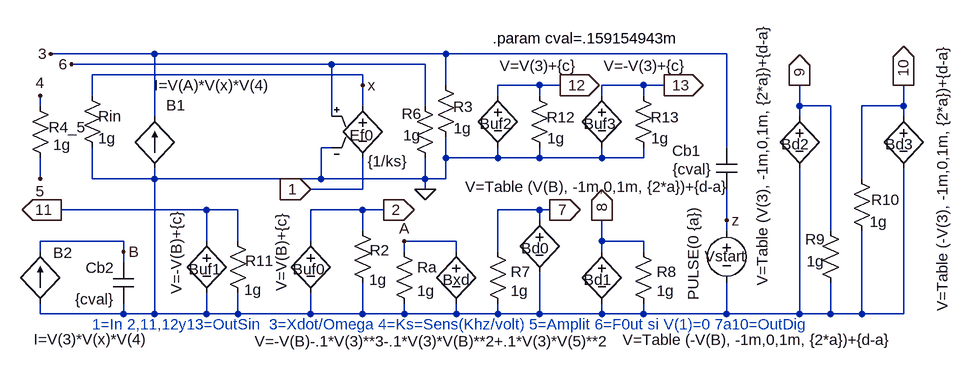
[diagram p0: schematic vcodig.asc]
vcodig.asc, the LTspice schematic file:
Version 4
SHEET 1 1252 680
WIRE -336 176 -336 160
WIRE -336 288 -336 256
WIRE -336 400 -336 384
WIRE -336 496 -336 480
WIRE -256 160 -256 128
WIRE -256 288 -256 240
WIRE -208 384 -336 384
WIRE -208 400 -208 384
WIRE -208 416 -208 400
WIRE -208 496 -336 496
WIRE -208 496 -208 480
WIRE -160 96 -320 96
WIRE -160 192 -160 96
WIRE -160 288 -256 288
WIRE -160 288 -160 272
WIRE -160 496 -208 496
WIRE -160 496 -160 288
WIRE -80 336 -304 336
WIRE -80 384 -80 336
WIRE -80 496 -160 496
WIRE -80 496 -80 464
WIRE -32 336 -80 336
WIRE -32 384 -32 336
WIRE -32 496 -80 496
WIRE -32 496 -32 464
WIRE 80 384 80 336
WIRE 80 496 -32 496
WIRE 80 496 80 464
WIRE 96 288 -160 288
WIRE 96 288 96 240
WIRE 112 112 -288 112
WIRE 112 192 112 112
WIRE 112 240 96 240
WIRE 160 128 -256 128
WIRE 160 144 160 128
WIRE 160 176 160 144
WIRE 160 304 80 304
WIRE 160 304 160 256
WIRE 160 336 80 336
WIRE 160 368 160 336
WIRE 160 496 80 496
WIRE 160 496 160 448
WIRE 192 336 160 336
WIRE 224 400 224 384
WIRE 224 496 160 496
WIRE 224 496 224 480
WIRE 256 112 112 112
WIRE 256 176 256 112
WIRE 256 288 96 288
WIRE 256 288 256 256
WIRE 256 304 256 288
WIRE 288 96 -160 96
WIRE 288 144 288 96
WIRE 288 256 288 224
WIRE 288 288 256 288
WIRE 288 288 288 256
WIRE 304 384 224 384
WIRE 304 400 304 384
WIRE 304 496 224 496
WIRE 304 496 304 480
WIRE 368 160 368 144
WIRE 368 256 288 256
WIRE 368 256 368 240
WIRE 368 400 368 336
WIRE 368 496 304 496
WIRE 368 496 368 480
WIRE 432 144 368 144
WIRE 432 160 432 144
WIRE 432 256 368 256
WIRE 432 256 432 240
WIRE 432 336 368 336
WIRE 432 352 432 336
WIRE 432 496 368 496
WIRE 432 496 432 432
WIRE 448 336 432 336
WIRE 464 144 432 144
WIRE 528 160 528 144
WIRE 528 256 432 256
WIRE 528 256 528 240
WIRE 528 384 528 352
WIRE 528 400 528 384
WIRE 528 496 432 496
WIRE 528 496 528 480
WIRE 592 144 528 144
WIRE 592 160 592 144
WIRE 592 256 528 256
WIRE 592 256 592 240
WIRE 592 384 528 384
WIRE 592 400 592 384
WIRE 592 496 528 496
WIRE 592 496 592 480
WIRE 624 144 592 144
WIRE 720 96 288 96
WIRE 720 240 720 96
WIRE 720 352 720 304
WIRE 720 368 720 352
WIRE 720 496 592 496
WIRE 720 496 720 448
WIRE 832 176 832 144
WIRE 832 192 832 176
WIRE 832 496 720 496
WIRE 832 496 832 272
WIRE 880 176 832 176
WIRE 880 368 880 176
WIRE 880 496 832 496
WIRE 880 496 880 448
WIRE 928 288 928 176
WIRE 928 496 880 496
WIRE 928 496 928 368
WIRE 992 176 928 176
WIRE 992 176 992 144
WIRE 992 192 992 176
WIRE 992 496 928 496
WIRE 992 496 992 272
FLAG 256 304 0
FLAG 80 304 1
IOPIN 80 304 In
FLAG -320 96 3
FLAG -208 400 B
FLAG 224 384 A
FLAG 192 336 2
IOPIN 192 336 Out
FLAG 720 352 z
FLAG -336 160 4
FLAG -336 288 5
FLAG -288 112 6
FLAG 160 144 x
FLAG 448 336 7
IOPIN 448 336 Out
FLAG 464 144 12
IOPIN 464 144 Out
FLAG 832 144 9
IOPIN 832 144 Out
FLAG 528 352 8
IOPIN 528 352 Out
FLAG 992 144 10
IOPIN 992 144 Out
FLAG -304 336 11
IOPIN -304 336 Out
FLAG 624 144 13
IOPIN 624 144 Out
SYMBOL res -272 144 R0
WINDOW 0 25 48 Left 0
WINDOW 3 25 82 Left 0
SYMATTR InstName Rin
SYMATTR Value 1g
SYMBOL res 144 352 R0
WINDOW 0 27 46 Left 0
WINDOW 3 26 91 Left 0
SYMATTR InstName R2
SYMATTR Value 1g
SYMBOL bi -160 272 R180
WINDOW 0 -47 97 Left 0
WINDOW 3 -176 128 Left 0
SYMATTR InstName B1
SYMATTR Value I=V(A)*V(x)*V(4)
SYMBOL bi -336 480 R180
WINDOW 0 -49 78 Left 0
WINDOW 3 -165 -55 Left 0
SYMATTR InstName B2
SYMATTR Value I=V(3)*V(x)*V(4)
SYMBOL cap -224 416 R0
WINDOW 3 -58 57 Left 0
WINDOW 0 -42 9 Left 0
SYMATTR Value {cval}
SYMATTR InstName Cb2
SYMATTR SpiceLine Rpar=1g
SYMBOL bv 304 384 R0
WINDOW 0 -21 59 Left 0
WINDOW 3 -310 154 Left 0
SYMATTR InstName Bxd
SYMATTR Value V=-V(B)-.1*V(3)**3-.1*V(3)*V(B)**2+.1*V(3)*V(5)**2
SYMBOL res 208 384 R0
SYMATTR InstName Ra
SYMATTR Value 1g
SYMBOL voltage 720 352 R0
WINDOW 0 -34 55 Left 0
WINDOW 3 -51 -22 VRight 0
WINDOW 123 0 0 Left 0
WINDOW 39 0 0 Left 0
SYMATTR InstName Vstart
SYMATTR Value PULSE(0 {a})
SYMBOL cap 704 240 R0
WINDOW 0 -68 5 Left 0
WINDOW 3 -8 33 Right 0
SYMATTR InstName Cb1
SYMATTR Value {cval}
SYMBOL res -352 160 R0
WINDOW 0 29 49 Left 0
SYMATTR InstName R4_5
SYMATTR Value 1g
SYMBOL res 240 160 R0
WINDOW 0 -20 28 Left 0
WINDOW 3 -18 61 Left 0
SYMATTR InstName R6
SYMATTR Value 1g
SYMBOL e 160 160 R0
WINDOW 0 -20 61 Left 0
WINDOW 3 8 101 Left 0
SYMATTR InstName Ef0
SYMATTR Value {1/ks}
SYMBOL bv 432 336 R0
WINDOW 0 -28 59 Left 0
WINDOW 3 -114 -36 Left 0
SYMATTR InstName Bd0
SYMATTR Value V=Table (V(B), -1m,0,1m, {2*a})+{d-a}
SYMBOL res 352 384 R0
WINDOW 0 36 47 Left 0
SYMATTR InstName R7
SYMATTR Value 1g
SYMBOL res 272 128 R0
WINDOW 0 27 49 Left 0
WINDOW 3 28 82 Left 0
SYMATTR InstName R3
SYMATTR Value 1g
SYMBOL res 416 144 R0
WINDOW 0 27 49 Left 0
WINDOW 3 28 82 Left 0
SYMATTR InstName R12
SYMATTR Value 1g
SYMBOL bv 832 176 R0
WINDOW 0 -28 59 Left 0
WINDOW 3 -57 -131 VRight 0
SYMATTR InstName Bd2
SYMATTR Value V=Table (V(3), -1m,0,1m, {2*a})+{d-a}
SYMBOL bv 528 384 R0
WINDOW 0 -28 59 Left 0
WINDOW 3 32 152 Left 0
SYMATTR InstName Bd1
SYMATTR Value V=Table (-V(B), -1m,0,1m, {2*a})+{d-a}
SYMBOL bv 992 176 R0
WINDOW 0 -28 59 Left 0
WINDOW 3 60 316 VLeft 0
SYMATTR InstName Bd3
SYMATTR Value V=Table (-V(3), -1m,0,1m, {2*a})+{d-a}
SYMBOL bv 368 144 R0
WINDOW 0 -28 59 Left 0
WINDOW 3 3 -30 Left 0
SYMATTR InstName Buf2
SYMATTR Value V=V(3)+{c}
SYMBOL bv 80 368 R0
WINDOW 0 -28 59 Left 0
WINDOW 3 -45 -27 VRight 0
SYMATTR InstName Buf0
SYMATTR Value V=V(B)+{c}
SYMBOL bv -80 368 R0
WINDOW 0 -28 59 Left 0
WINDOW 3 -47 -31 VRight 0
SYMATTR InstName Buf1
SYMATTR Value V=-V(B)+{c}
SYMBOL res -48 368 R0
WINDOW 0 27 46 Left 0
WINDOW 3 26 91 Left 0
SYMATTR InstName R11
SYMATTR Value 1g
SYMBOL res 864 352 R0
WINDOW 0 -23 29 Left 0
WINDOW 3 -21 63 Left 0
SYMATTR InstName R9
SYMATTR Value 1g
SYMBOL res 576 384 R0
WINDOW 0 36 47 Left 0
SYMATTR InstName R8
SYMATTR Value 1g
SYMBOL res 576 144 R0
WINDOW 0 27 49 Left 0
WINDOW 3 28 82 Left 0
SYMATTR InstName R13
SYMATTR Value 1g
SYMBOL bv 528 144 R0
WINDOW 0 -28 59 Left 0
WINDOW 3 3 -30 Left 0
SYMATTR InstName Buf3
SYMATTR Value V=-V(3)+{c}
SYMBOL res 912 272 R0
WINDOW 0 30 48 Left 0
WINDOW 3 28 82 Left 0
SYMATTR InstName R10
SYMATTR Value 1g
TEXT -256 512 Left 0 ;1=In 2,11,12y13=OutSin  3=Xdot/Omega 4=Ks=Sens(Khz/volt) 5=Amplit 6=F0ut si V(1)=0 7a10=OutDig
TEXT 360 72 Left 0 !.param cval=.159154943m

The netlist it stands for:
* vcodig.asc
Rin x 0 1g
R2 2 0 1g
B1 0 3 I=V(A)*V(x)*V(4)
B2 0 B I=V(3)*V(x)*V(4)
Cb2 B 0 {cval} Rpar=1g
Bxd A 0 V=-V(B)-.1*V(3)**3-.1*V(3)*V(B)**2+.1*V(3)*V(5)**2
Ra A 0 1g
Vstart z 0 PULSE(0 {a})
Cb1 3 z {cval}
R4_5 4 5 1g
R6 6 0 1g
Ef0 x 1 6 0 {1/ks}
Bd0 7 0 V=Table (V(B), -1m,0,1m, {2*a})+{d-a}
R7 7 0 1g
R3 3 0 1g
R12 12 0 1g
Bd2 9 0 V=Table (V(3), -1m,0,1m, {2*a})+{d-a}
Bd1 8 0 V=Table (-V(B), -1m,0,1m, {2*a})+{d-a}
Bd3 10 0 V=Table (-V(3), -1m,0,1m, {2*a})+{d-a}
Buf2 12 0 V=V(3)+{c}
Buf0 2 0 V=V(B)+{c}
Buf1 11 0 V=-V(B)+{c}
R11 11 0 1g
R9 9 0 1g
R8 8 0 1g
R13 13 0 1g
Buf3 13 0 V=-V(3)+{c}
R10 10 0 1g
* 1=In 2,11,12y13=OutSin  3=Xdot/Omega 4=Ks=Sens(Khz/volt) 5=Amplit 6=F0ut si V(1)=0 7a10=OutDig
.param cval=.159154943m
.backanno
.end